# Altium project AMC_uBACKPLANE.PrjPcb (part 2 of 4)

## Sheet CLKs.SchDoc: CLKs
size 420 x 297 mm; Organization: Altium Limited; Address1: L3, 12a Rodborough Rd; Address2: Frenchs Forest; Address3: NSW; Address4: Australia 2086; DocumentNumber: 13; SheetNumber: 8; SheetTotal: 15
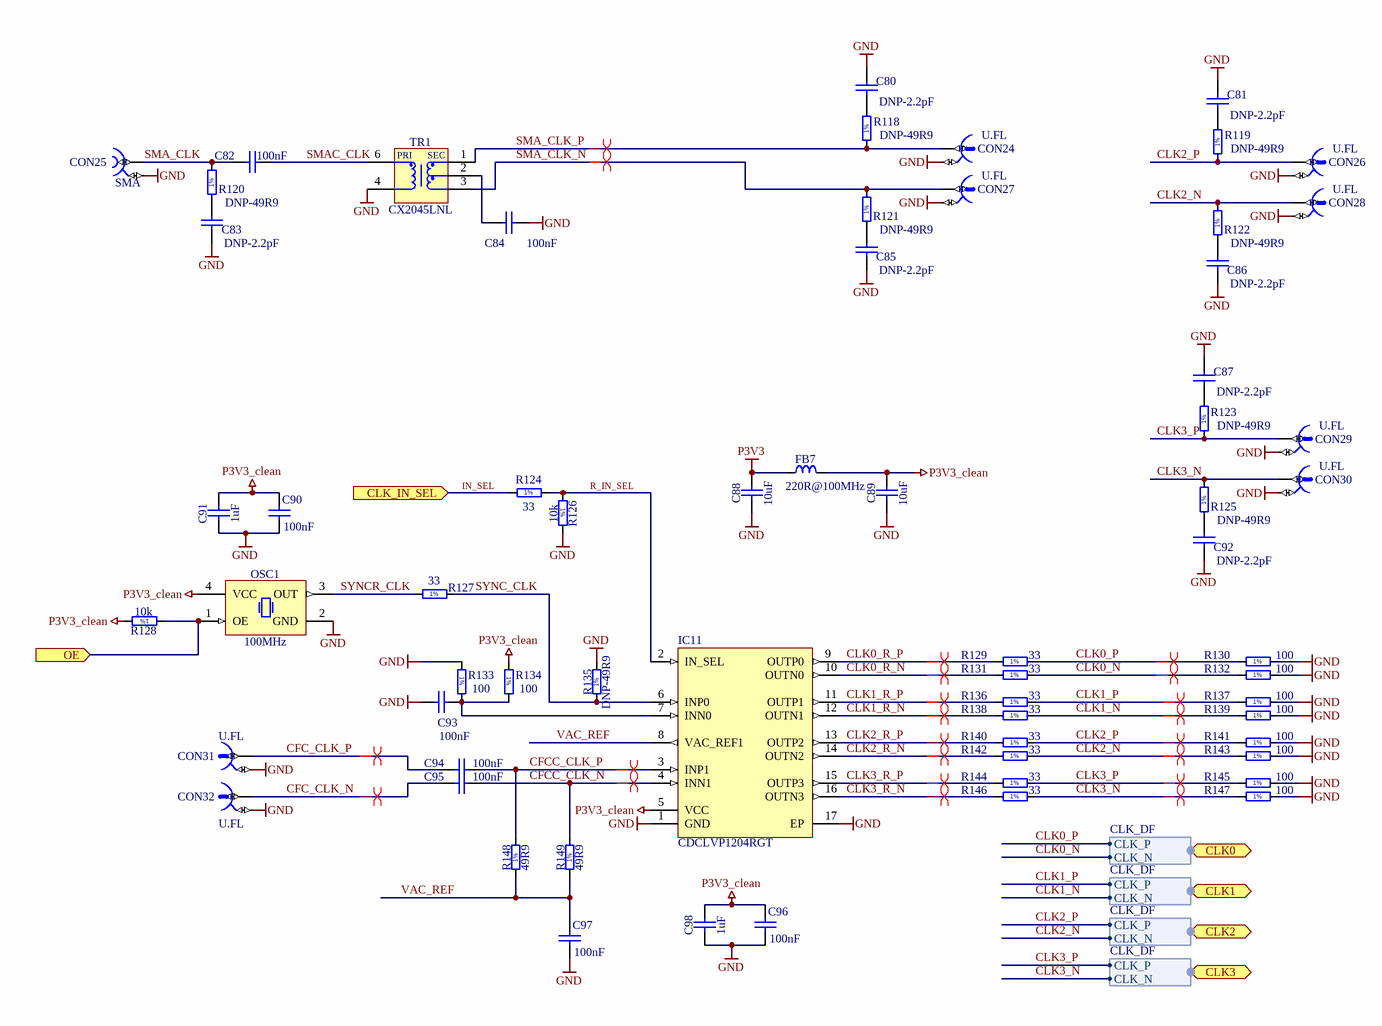
[diagram p4: CLKs.SchDoc]

### Parts
C80  DNP-2.2pF  [CAPC1005X55N]
C81  DNP-2.2pF  [CAPC1005X55N]
C82  100nF  [CAPC0603X33N]
C83  DNP-2.2pF  [CAPC1005X55N]
C84  100nF  [CAPC0603X33N]
C85  DNP-2.2pF  [CAPC1005X55N]
C86  DNP-2.2pF  [CAPC1005X55N]
C87  DNP-2.2pF  [CAPC1005X55N]
C88  10uF  [CAPC2012X135N]
C89  10uF  [CAPC2012X135N]
C90  100nF  [CAPC0603X33N]
C91  1uF  [CAPC1608X87N]
C92  DNP-2.2pF  [CAPC1005X55N]
C93  100nF  [CAPC1005X55N]
C94  100nF  [CAPC0603X33N]
C95  100nF  [CAPC0603X33N]
C96  100nF  [CAPC0603X33N]
C97  100nF  [CAPC1005X55N]
C98  1uF  [CAPC1608X87N]
CON24  U.FL  [HIROSE_U.FL-R-SMT-1(10)]
CON25  SMA  [HUBER-SUHNER_85 SMA-50-0-101/111 NE]
CON26  U.FL  [HIROSE_U.FL-R-SMT-1(10)]
CON27  U.FL  [HIROSE_U.FL-R-SMT-1(10)]
CON28  U.FL  [HIROSE_U.FL-R-SMT-1(10)]
CON29  U.FL  [HIROSE_U.FL-R-SMT-1(10)]
CON30  U.FL  [HIROSE_U.FL-R-SMT-1(10)]
CON31  U.FL  [HIROSE_U.FL-R-SMT-1(10)]
CON32  U.FL  [HIROSE_U.FL-R-SMT-1(10)]
FB7  220R@100MHz  [INDC2012X105N]
IC11  CDCLVP1204RGT  [QFN50P300X300X100-17N-S165]
OSC1  100MHz  [OSC_EPSON_SG-8002CA]
R118  DNP-49R9  [RESC1005X40N]
R119  DNP-49R9  [RESC1005X40N]
R120  DNP-49R9  [RESC1005X40N]
R121  DNP-49R9  [RESC1005X40N]
R122  DNP-49R9  [RESC1005X40N]
R123  DNP-49R9  [RESC1005X40N]
R124  33  [RESC1005X40N]
R125  DNP-49R9  [RESC1005X40N]
R126  10k  [RESC1005X40N]
R127  33  [RESC1005X40N]
R128  10k  [RESC1005X40N]
R129  33  [RESC1005X40N]
R130  100  [RESC1005X40N]
R131  33  [RESC1005X40N]
R132  100  [RESC1005X40N]
R133  100  [RESC1005X40N]
R134  100  [RESC1005X40N]
R135  DNP-49R9  [RESC1005X40N]
R136  33  [RESC1005X40N]
R137  100  [RESC1005X40N]
R138  33  [RESC1005X40N]
R139  100  [RESC1005X40N]
R140  33  [RESC1005X40N]
R141  100  [RESC1005X40N]
R142  33  [RESC1005X40N]
R143  100  [RESC1005X40N]
R144  33  [RESC1005X40N]
R145  100  [RESC1005X40N]
R146  33  [RESC1005X40N]
R147  100  [RESC1005X40N]
R148  49R9  [RESC1005X40N]
R149  49R9  [RESC1005X40N]
TR1  CX2045LNL  [PULSE_CX2045LNL]

### Ports
CLK0 (harness CLK_DF), CLK1 (harness CLK_DF), CLK2 (harness CLK_DF), CLK3 (harness CLK_DF), CLK_IN_SEL (in), OE (in)

### Harnesses
CLK_DF: CLK_P, CLK_N

### Nets
GND: C80.2 C81.2 C83.2 C84.1 C85.2 C86.2 C87.2 C88.1 C89.1 C90.1 C91.1 C92.2 C93.1 C96.1 C97.1 C98.1 CON24.2 CON25.2 CON26.2 CON27.2 CON28.2 CON29.2 CON30.2 CON31.2 CON32.2 IC11.1(GND) IC11.17(EP) OSC1.2(GND) R126.2 R130.2 R132.2 R133.1 R135.2 R137.2 R139.2 R141.2 R143.2 R145.2 R147.2 TR1.4
P3V3: C88.2 FB7.1
P3V3_clean: C89.2 C90.2 C91.2 C96.2 C98.2 FB7.2 IC11.5(VCC) OSC1.4(VCC) R128.2 R134.1
CFC_CLK_N: C95.2 CON32.1
CFC_CLK_P: C94.2 CON31.1
CFCC_CLK_N: C95.1 IC11.4(INN1) R149.2
CFCC_CLK_P: C94.1 IC11.3(INP1) R148.2
CLK0_N: R131.2 R132.1 ; port CLK0.CLK_N
CLK0_P: R129.2 R130.1 ; port CLK0.CLK_P
CLK0_R_N: IC11.10(OUTN0) R131.1
CLK0_R_P: IC11.9(OUTP0) R129.1
CLK1_N: R138.2 R139.1 ; port CLK1.CLK_N
CLK1_P: R136.2 R137.1 ; port CLK1.CLK_P
CLK1_R_N: IC11.12(OUTN1) R138.1
CLK1_R_P: IC11.11(OUTP1) R136.1
CLK2_N: CON28.1 R122.2 R142.2 R143.1 ; port CLK2.CLK_N
CLK2_P: CON26.1 R119.1 R140.2 R141.1 ; port CLK2.CLK_P
CLK2_R_N: IC11.14(OUTN2) R142.1
CLK2_R_P: IC11.13(OUTP2) R140.1
CLK3_N: CON30.1 R125.2 R146.2 R147.1 ; port CLK3.CLK_N
CLK3_P: CON29.1 R123.1 R144.2 R145.1 ; port CLK3.CLK_P
CLK3_R_N: IC11.16(OUTN3) R146.1
CLK3_R_P: IC11.15(OUTP3) R144.1
CLK_EN: OSC1.1(OE) R128.1 ; port OE
IN_SEL: R124.1 ; port CLK_IN_SEL  [project net CLK_SEL]
R_IN_SEL: IC11.2(IN_SEL) R124.2 R126.1
SMA_CLK: C82.2 CON25.1 R120.2
SMA_CLK_N: CON27.1 R121.2 TR1.3
SMA_CLK_P: CON24.1 R118.1 TR1.1
SMAC_CLK: C82.1 TR1.6
SYNC_CLK: IC11.6(INP0) R127.2 R135.1
SYNCR_CLK: OSC1.3(OUT) R127.1
VAC_REF: C97.2 IC11.8(VAC_REF1) R148.1 R149.1
NetC80_1: C80.1 R118.2
NetC81_1: C81.1 R119.2
NetC83_1: C83.1 R120.1
NetC84_2: C84.2 TR1.2
NetC85_1: C85.1 R121.1
NetC86_1: C86.1 R122.1
NetC87_1: C87.1 R123.2
NetC92_1: C92.1 R125.1
NetC93_2: C93.2 IC11.7(INN0) R133.2 R134.2

### Layout directives
differential pair: CFC_CLK_N, CFC_CLK_P, CFCC_CLK_N, CFCC_CLK_P, CLK0_N, CLK0_P, CLK0_R_N, CLK0_R_P, CLK1_N, CLK1_P, CLK1_R_N, CLK1_R_P, CLK2_N, CLK2_P, CLK2_R_N, CLK2_R_P, CLK3_N, CLK3_P, CLK3_R_N, CLK3_R_P, SMA_CLK_N, SMA_CLK_P

### Notes on the sheet
- Project/Equipment
- Document
- uTCA RTM 8 SFP+
- Designer
- Drawn by
- Check.by
- Copyright Creotech Instruments SA 2014.
  This documentation describes Open Hardware and is licensed under the CERN OHL v.1.1. You may redistribute and modify this documentation under the terms of the CERN OHL v.1.1. (http://ohwr.org/CERNOHL). This documentation is distributed WITHOUT ANY EXPRESS OR IMPLIED WARRANTY, INCLUDING OF MERCHANTABILITY, SATISFACTORY QUALITY AND FITNESS FOR A PARTICULAR PURPOSE. Please see the CERN OHL v.1.1 for applicable conditions.
- Creotech Instruments S.A.
- File
- Last Mod.
- Print Date
- Sheet
- Size
- A3
- of
- Rev
- (in symbol PULSE_CX2045LNL) PRI; SEC
- (in symbol R0402_10K_1%_0.0625W_100PPM) 1%
- (in symbol R0402_33R_1%_0.0625W_100PPM) 1%
- (in symbol R0402_49R9_1%_0.0625W_100PPM) 1%
- (in symbol R0402_100R_1%_0.0625W_100PPM) 1%

### Library data of the parts
C80 C81 C83 C85-C87 C92 = CC0402_2.2PF_50V_0.25PF_NP0: Non-polarised capacitor; Part Description: SMD Multilayer Chip Ceramic Capacitor; Manufacturer: GENERIC; Manufacturer1 Part Number: 223886915228; Voltage: 50V; TC: NP0; Tolerance: ±0.25pF; Table: Capacitors SMD; Part Number: CC0402_2.2PF_50V_0.25PF_NP0; Component Kind: Standard; Component Type: Standard; Pin Count: 2; Value: DNP-2.2pF; Status: Not Recommended; Manufacturer Part Number: CC0402_2.2PF_50V_0.25PF_NP0; Case: 0402; Mounted: Yes; Socket: No; SMD: Yes; Manufacturer1 Example: PHYCOMP; Manufacturer1 ComponentHeight: 0.55mm; HelpURL: \\cern.ch\dfs\Applications\Altium\Datasheets\CC0402_NP0_PHYCOMP.pdf; Author: CERN DEM JLC; CreateDate: 2007-12-03; LatestRevisionDate: 2007-12-03
C82 C84 C90 C94-C96 = CC0201_100NF_6.3V_10%_X5R: as C27 on sheet CPU; Part Number: CC0201_100NF_6.3V_10%_X5R; Component Kind: Standard; Component Type: Standard; Pin Count: 2; Value: 100nF; Status: Not Recommended; Manufacturer Part Number: CC0201_100NF_6.3V_10%_X5R; Case: 0201; Mounted: Yes; Socket: No; SMD: Yes; Manufacturer1 Example: AVX; Manufacturer1 ComponentHeight: 0.33mm; HelpURL: \\cern.ch\dfs\Applications\Altium\Datasheets\CC0201_X5R_AVX.pdf; Author: CERN DEM JLC; CreateDate: 2007-12-03; LatestRevisionDate: 2007-12-03
C88 C89 = CC0805_10UF_10V_10%_X7R: Non-polarised capacitor; Part Description: SMD Multilayer Chip Ceramic Capacitor; Manufacturer: GENERIC; Manufacturer1 Part Number: GRM21BR71A106KE51L; Voltage: 10V; TC: X7R; Tolerance: ±10%; Table: Capacitors SMD; Part Number: CC0805_10UF_10V_10%_X7R; Component Kind: Standard; Component Type: Standard; Pin Count: 2; Value: 10uF; Status: Preferred; Manufacturer Part Number: CC0805_10UF_10V_10%_X7R; Case: 0805; Mounted: Yes; Socket: No; SMD: Yes; Manufacturer1 Example: MURATA; Manufacturer1 ComponentHeight: 1.35mm; HelpURL: \\cern.ch\dfs\Applications\Altium\Datasheets\CC0805_X7R_MURATA.pdf; Author: CERN DEM JLC; CreateDate: 2012-04-30; LatestRevisionDate: 2012-04-30
C91 C98 = CC0603_1UF_25V_10%_X7R: Non-polarised capacitor; Part Description: SMD Multilayer Chip Ceramic Capacitor; Manufacturer: GENERIC; Manufacturer1 Part Number: GRM188R71E105KA12D; Voltage: 25V; TC: X7R; Tolerance: ±10%; Table: Capacitors SMD; Part Number: CC0603_1UF_25V_10%_X7R; Component Kind: Standard; Component Type: Standard; Pin Count: 2; Value: 1uF; Status: None; Manufacturer Part Number: CC0603_1UF_25V_10%_X7R; Case: 0603; Mounted: Yes; Socket: No; SMD: Yes; Manufacturer1 Example: MURATA; Manufacturer1 ComponentHeight: 0.9mm; HelpURL: \\cern.ch\dfs\Applications\Altium\Datasheets\CC0603_X7R_MURATA.pdf; Author: CERN DEM JLC; CreateDate: 2011-01-18; LatestRevisionDate: 2011-01-18
C93 C97 = CC0402_100NF_16V_10%_X7R: Non-polarised capacitor; Part Description: SMD Multilayer Chip Ceramic Capacitor; Manufacturer: GENERIC; Manufacturer1 Part Number: 223878715649; Voltage: 16V; TC: X7R; Tolerance: ±10%; Table: Capacitors SMD; Part Number: CC0402_100NF_16V_10%_X7R; Component Kind: Standard; Component Type: Standard; Pin Count: 2; Value: 100nF; Status: Not Recommended; Manufacturer Part Number: CC0402_100NF_16V_10%_X7R; Case: 0402; Mounted: Yes; Socket: No; SMD: Yes; Manufacturer1 Example: PHYCOMP; Manufacturer1 ComponentHeight: 0.55mm; HelpURL: \\cern.ch\dfs\Applications\Altium\Datasheets\CC0402_X7R_PHYCOMP.pdf; Author: CERN DEM JLC; CreateDate: 2007-12-03; LatestRevisionDate: 2007-12-03
CON24 CON26-CON32 = HIROSE_U.FL-R-SMT-1(10): Part Description: Up to 6GHz Ultra Small Surface Mount Male Coaxial Connectors U.FL Series; Manufacturer: HIROSE (HRS); Table: Miscellaneous; Part Number: HIROSE_U.FL-R-SMT-1(10); Component Kind: Standard; Component Type: Standard; Pin Count: 2; Family: U.FL; Mounted: Yes; Socket: No; SMD: Yes; Status: None; Manufacturer Part Number: U.FL-R-SMT-1(10); ComponentHeight: 1.25mm; HelpURL: \\cern.ch\dfs\Applications\Altium\Datasheets\HIROSE_U.FL-R-SMT-1(10).pdf; Author: CERN DEM JLC; CreateDate: 2010-03-24; LatestRevisionDate: 2010-03-24
CON25 = HUBER-SUHNER_85_SMA-50-0-101/111_NE: Part Description: SMA 50 Ohms Right Angle PCB Jack; Manufacturer: HUBER+SUHNER; Table: Miscellaneous; Part Number: HUBER-SUHNER_85_SMA-50-0-101/111_NE; Component Kind: Standard; Component Type: Standard; Pin Count: 2; Family: SMA; Mounted: Yes; Socket: No; SMD: No; Status: None; Manufacturer Part Number: 85_SMA-50-0-101/111_NE; ComponentHeight: 9.6mm; HelpURL: \\cern.ch\dfs\Applications\Altium\Datasheets\HUBER-SUHNER_85 SMA-50-0-101-111 NE.pdf; Author: CERN DEM JLC; CreateDate: 2010-04-20; LatestRevisionDate: 2010-04-27
FB7 = IND0805_MURATA_BLM21PG221SN1D: Inductor; Part Description: SMD EMIFIL Suppression Chip Ferrite Bead; Manufacturer: MURATA; Power: 2A; Resistance: 0.05R; Tolerance: ±25%; Table: Inductors SMD; Part Number: IND0805_MURATA_BLM21PG221SN1D; Component Kind: Standard; Component Type: Standard; Pin Count: 2; Value: 220R@100MHz; Status: None; Manufacturer Part Number: BLM21PG221SN1D; Case: 0805; Mounted: Yes; Socket: No; SMD: Yes; ComponentHeight: 1.05mm; HelpURL: \\cern.ch\dfs\Applications\Altium\Datasheets\IND0402_MURATA_BLM21P.pdf; Author: CERN DEM JLC; CreateDate: 2010-01-25; LatestRevisionDate: 2010-01-25
IC11 = CDCLVP1204RGT: 2:2 Low Additive Jitter LVPECL Buffer
OSC1 = OSC_100MHZ_EPSON_SG-8002CAPCB100MHZ: Oscillator 4 pins 1=OE 2=GND 3=OUT 4=VCC; Part Description: 3.3V ±50ppm 15pF -40..85°C, Output Enable Function , Surface Mount Crystal Oscillator (SG-8002CA Serie); Manufacturer: EPSON-TOYOCOM; Table: Crystals & Oscillators; Part Number: OSC_100MHZ_EPSON_SG-8002CAPCB100MHZ; Component Kind: Standard; Component Type: Standard; PackageDescription: SMD Oscillator, Side Convave, 4 pins, 5.00x7.00mm SG-8002CA Serie; Value: 100MHz; Manufacturer Part Number: SG-8002CA PCB 100MHZ; Pin Count: 4; Mounted: Yes; Socket: No; SMD: Yes; ComponentHeight: 1.5mm; HelpURL: \\cern.ch\dfs\Applications\Altium\Datasheets\OSC_EPSON_SG-8002CA.pdf; Author: CERN DEM JLC; CreateDate: 2011-05-02; LatestRevisionDate: 2011-05-02
R118-R123 R125 R135 R148 R149 = R0402_49R9_1%_0.0625W_100PPM: Resistor - 1%; Part Description: General Purpose Thick Film Chip Resistor; Manufacturer: GENERIC; Manufacturer1 Part Number: 232270674999L or RC0402FR-0749R9L; TC: ±100ppm/°C; Table: Resistors SMD; Part Number: R0402_49R9_1%_0.0625W_100PPM; Component Kind: Standard; Component Type: Standard; Pin Count: 2; Status: Not recommended; Power: 0.0625W; Tolerance: ±1%; Manufacturer Part Number: R0402_49R9_1%_0.0625W_100PPM; Case: 0402; Mounted: Yes; Socket: No; SMD: Yes; Manufacturer1 Example: YAGEO PHYCOMP; Manufacturer1 ComponentHeight: 0.4mm; HelpURL: \\cern.ch\dfs\Applications\Altium\Datasheets\R0402_Phycomp_RC0402.pdf; Author: CERN DEM JLC; CreateDate: 2012-10-24; LatestRevisionDate: 2012-10-24
  R118-R123 R125 R135: Value: DNP-49R9
  R148 R149: Value: 49R9
R124 R127 R129 R131 R136 R138 R140 R142 R144 R146 = R0402_33R_1%_0.0625W_100PPM: Resistor - 1%; Part Description: General Purpose Thick Film Chip Resistor; Manufacturer: GENERIC; Manufacturer1 Part Number: 232270673309L; TC: ±100ppm/°C; Table: Resistors SMD; Part Number: R0402_33R_1%_0.0625W_100PPM; Component Kind: Standard; Component Type: Standard; Pin Count: 2; Value: 33; Status: Not recommended; Power: 0.0625W; Tolerance: ±1%; Manufacturer Part Number: R0402_33R_1%_0.0625W_100PPM; Case: 0402; Mounted: Yes; Socket: No; SMD: Yes; Manufacturer1 Example: YAGEO PHYCOMP; Manufacturer1 ComponentHeight: 0.4mm; HelpURL: \\cern.ch\dfs\Applications\Altium\Datasheets\R0402_Phycomp_RC0402.pdf; Author: CERN DEM JLC; CreateDate: 2007-12-03; LatestRevisionDate: 2012-10-17
R126 R128 = R0402_10K_1%_0.0625W_100PPM: Resistor - 1%; Part Description: General Purpose Thick Film Chip Resistor; Manufacturer: GENERIC; Manufacturer1 Part Number: 232270671003L; TC: ±100ppm/°C; Table: Resistors SMD; Part Number: R0402_10K_1%_0.0625W_100PPM; Component Kind: Standard; Component Type: Standard; Pin Count: 2; Value: 10k; Status: Not recommended; Power: 0.0625W; Tolerance: ±1%; Manufacturer Part Number: R0402_10K_1%_0.0625W_100PPM; Case: 0402; Mounted: Yes; Socket: No; SMD: Yes; Manufacturer1 Example: YAGEO PHYCOMP; Manufacturer1 ComponentHeight: 0.4mm; HelpURL: \\cern.ch\dfs\Applications\Altium\Datasheets\R0402_Phycomp_RC0402.pdf; Author: CERN DEM JLC; CreateDate: 2007-12-03; LatestRevisionDate: 2012-10-17
R130 R132-R134 R137 R139 R141 R143 R145 R147 = R0402_100R_1%_0.0625W_100PPM: Resistor - 1%; Part Description: General Purpose Thick Film Chip Resistor; Manufacturer: GENERIC; Manufacturer1 Part Number: 232270671001L; TC: ±100ppm/°C; Table: Resistors SMD; Part Number: R0402_100R_1%_0.0625W_100PPM; Component Kind: Standard; Component Type: Standard; Pin Count: 2; Value: 100; Status: Not recommended; Power: 0.0625W; Tolerance: ±1%; Manufacturer Part Number: R0402_100R_1%_0.0625W_100PPM; Case: 0402; Mounted: Yes; Socket: No; SMD: Yes; Manufacturer1 Example: YAGEO PHYCOMP; Manufacturer1 ComponentHeight: 0.4mm; HelpURL: \\cern.ch\dfs\Applications\Altium\Datasheets\R0402_Phycomp_RC0402.pdf; Author: CERN DEM JLC; CreateDate: 2007-12-03; LatestRevisionDate: 2012-10-17
TR1 = PULSE_CX2045LNL: Balun (Ruthroff Balun Transformer) Impedance - Unbalanced/Balanced 1:2 (1:1.41 Turn Ratio)

## Sheet SFP.SchDoc: SFP
size 420 x 297 mm; Organization: Altium Limited; Address1: L3, 12a Rodborough Rd; Address2: Frenchs Forest; Address3: NSW; Address4: Australia 2086; DocumentNumber: 15; SheetNumber: 5; SheetTotal: 15
Used 4 times, as channels SFPA1, SFPA0, SFPB1, SFPB0. Parts and nets are listed once, with the designators drawn on the sheet.
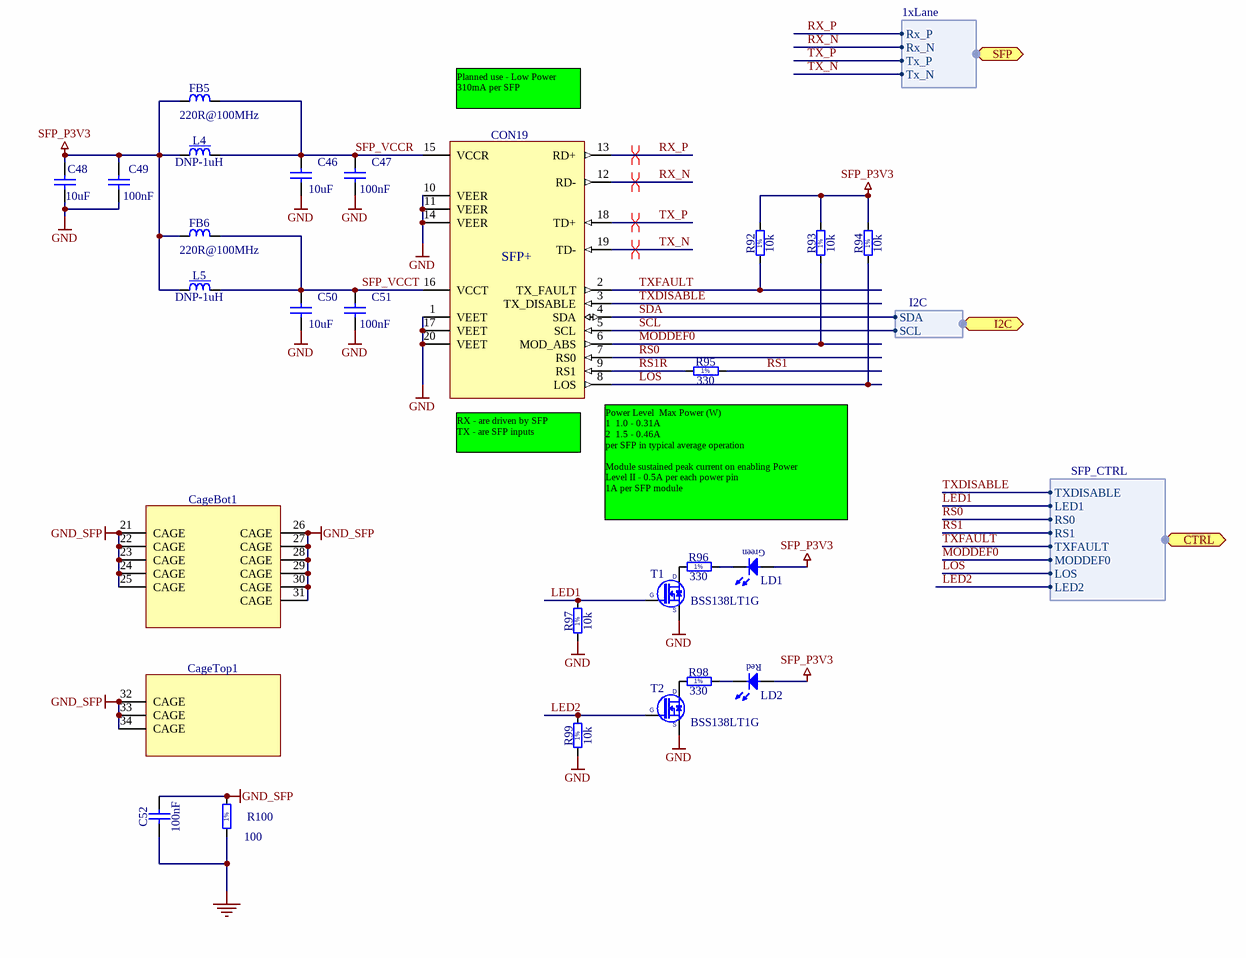
[diagram p5: SFP.SchDoc]

### Parts
C46  10uF  [CAPC2012X135N]
C47  100nF  [CAPC1005X55N]
C48  10uF  [CAPC2012X135N]
C49  100nF  [CAPC1005X55N]
C50  10uF  [CAPC2012X135N]
C51  100nF  [CAPC1005X55N]
C52  100nF  [CAPC1005X55N]
CageBot1  6367034-1  [TYCO_6367034-1]  (value not drawn)
CageTop1  6367035-1  [TYCO_6367035-1]  (value not drawn)
CON19  1888247-1  [TYCO_1888247-1]  (value not drawn)
FB5  220R@100MHz  [INDC2012X105N]
FB6  220R@100MHz  [INDC2012X105N]
L4  DNP-1uH  [IND_MURATA_LQH32]
L5  DNP-1uH  [IND_MURATA_LQH32]
LD1  LED_AVAGO_HSME-C120  [LED_AVAGO_HSME-C120]  (value not drawn)
LD2  LED_AVAGO_HSMC-C120  [LED_AVAGO_HSMC-C120]  (value not drawn)
R92  10k  [RESC1005X40N]
R93  10k  [RESC1005X40N]
R94  10k  [RESC1005X40N]
R95  330  [RESC1608X55N]
R96  330  [RESC1608X55N]
R97  10k  [RESC1005X40N]
R98  330  [RESC1608X55N]
R99  10k  [RESC1005X40N]
R100  100  [RESC1005X40N]
T1  BSS138LT1G  [SOT95P240X110-3N]
T2  BSS138LT1G  [SOT95P240X110-3N]

### Ports
CTRL (harness SFP_CTRL), I2C (harness I2C), SFP (harness 1xLane)

### Harnesses
I2C: SCL, SDA
SFP_CTRL: LED1, TXFAULT, TXDISABLE, MODDEF0, RS0, RS1, LOS, LED2
1xLane: Rx_P, Rx_N, Tx_P, Tx_N

### Nets
GND: C46.2 C47.1 C48.2 C49.2 C50.2 C51.1 C52.1 CON19.1(VEET) CON19.10(VEER) CON19.11(VEER) CON19.14(VEER) CON19.17(VEET) CON19.20(VEET) R97.1 R99.1 R100.1 T1.2(S) T2.2(S)
GND_SFP: C52.2 CageBot1.21(CAGE) CageBot1.22(CAGE) CageBot1.23(CAGE) CageBot1.24(CAGE) CageBot1.25(CAGE) CageBot1.26(CAGE) CageBot1.27(CAGE) CageBot1.28(CAGE) CageBot1.29(CAGE) CageBot1.30(CAGE) CageBot1.31(CAGE) CageTop1.32(CAGE) CageTop1.33(CAGE) CageTop1.34(CAGE) R100.2
SFP_P3V3: C48.1 C49.1 FB5.1 FB6.1 L4.1 L5.1 LD1.2(A) LD2.2(A) R92.2 R93.2 R94.2
LED1: R97.2 T1.1(G) ; port CTRL.LED1
LED2: R99.2 T2.1(G) ; port CTRL.LED2
LOS: CON19.8(LOS) R94.1 ; port CTRL.LOS
MODDEF0: CON19.6(MOD_ABS) R93.1 ; port CTRL.MODDEF0
RS0: CON19.7(RS0) ; port CTRL.RS0
RS1: R95.2 ; port CTRL.RS1
RS1R: CON19.9(RS1) R95.1
RX_N: CON19.12(RD-) ; port SFP.Rx_N
RX_P: CON19.13(RD+) ; port SFP.Rx_P
SCL: CON19.5(SCL) ; port I2C.SCL
SDA: CON19.4(SDA) ; port I2C.SDA
SFP_VCCR: C46.1 C47.2 CON19.15(VCCR) FB5.2 L4.2
SFP_VCCT: C50.1 C51.2 CON19.16(VCCT) FB6.2 L5.2
TX_N: CON19.19(TD-) ; port SFP.Tx_N
TX_P: CON19.18(TD+) ; port SFP.Tx_P
TXDISABLE: CON19.3(TX_DISABLE) ; port CTRL.TXDISABLE
TXFAULT: CON19.2(TX_FAULT) R92.1 ; port CTRL.TXFAULT
NetLD1_1: LD1.1(C) R96.2
NetLD2_1: LD2.1(C) R98.2
NetR96_1: R96.1 T1.3(D)
NetR98_1: R98.1 T2.3(D)

### Channels
SFPA1: designators end in A
SFPA0: designators end in B
SFPB1: designators end in C
SFPB0: designators end in D

### Layout directives
differential pair: P1A_SFP.Rx_N, P1A_SFP.Rx_P, P1A_SFP.Tx_N, P1A_SFP.Tx_P

### Notes on the sheet
- (near CON19) Planned use - Low Power
  310mA per SFP
- (near CON19) RX - are driven by SFP
  TX - are SFP inputs
- Power Level  Max Power (W)
  1  1.0 - 0.31A
  2  1.5 - 0.46A
  per SFP in typical average operation
  Module sustained peak current on enabling Power
  Level II - 0.5A per each power pin
  1A per SFP module
- Project/Equipment
- Document
- uTCA RTM 8 SFP+
- Designer
- Drawn by
- Check.by
- Copyright Creotech Instruments SA 2014.
  This documentation describes Open Hardware and is licensed under the CERN OHL v.1.1. You may redistribute and modify this documentation under the terms of the CERN OHL v.1.1. (http://ohwr.org/CERNOHL). This documentation is distributed WITHOUT ANY EXPRESS OR IMPLIED WARRANTY, INCLUDING OF MERCHANTABILITY, SATISFACTORY QUALITY AND FITNESS FOR A PARTICULAR PURPOSE. Please see the CERN OHL v.1.1 for applicable conditions.
- Creotech Instruments S.A.
- File
- Last Mod.
- Print Date
- Sheet
- Size
- A3
- of
- Rev
- (in symbol R0402_10K_1%_0.0625W_100PPM) 1%
- (in symbol R0402_100R_1%_0.0625W_100PPM) 1%
- (in symbol R0603_330R_1%_0.1W_100PPM) 1%

### Library data of the parts
C46 C48 C50 = CC0805_10UF_10V_10%_X7R: as C88 on sheet CLKs; Part Number: CC0805_10UF_10V_10%_X7R; Component Kind: Standard; Component Type: Standard; Pin Count: 2; Value: 10uF; Status: Preferred; Manufacturer Part Number: CC0805_10UF_10V_10%_X7R; Case: 0805; Mounted: Yes; Socket: No; SMD: Yes; Manufacturer1 Example: MURATA; Manufacturer1 ComponentHeight: 1.35mm; HelpURL: \\cern.ch\dfs\Applications\Altium\Datasheets\CC0805_X7R_MURATA.pdf; Author: CERN DEM JLC; CreateDate: 2012-04-30; LatestRevisionDate: 2012-04-30
C47 C51 C52 = CC0402_100NF_16V_10%_X5R: Non-polarised capacitor; Part Description: SMD Multilayer Chip Ceramic Capacitor; Manufacturer: GENERIC; Manufacturer1 Part Number: GRM155R61C104KA88D; Voltage: 16V; TC: X5R; Tolerance: ±10%; Table: Capacitors SMD; Part Number: CC0402_100NF_16V_10%_X5R; Component Kind: Standard; Component Type: Standard; Pin Count: 2; Value: 100nF; Status: None; Manufacturer Part Number: CC0402_100NF_16V_10%_X5R; Case: 0402; Mounted: Yes; Socket: No; SMD: Yes; Manufacturer1 Example: MURATA; Manufacturer1 ComponentHeight: 0.55mm; HelpURL: \\cern.ch\dfs\Applications\Altium\Datasheets\CC0402_X5R_MURATA_GRM.pdf; Author: CERN DEM JLC; CreateDate: 2013-12-10; LatestRevisionDate: 2013-12-10
C49 = CC0402_100NF_16V_10%_X7R: as C93 on sheet CLKs; Part Number: CC0402_100NF_16V_10%_X7R; Component Kind: Standard; Component Type: Standard; Pin Count: 2; Value: 100nF; Status: Not Recommended; Manufacturer Part Number: CC0402_100NF_16V_10%_X7R; Case: 0402; Mounted: Yes; Socket: No; SMD: Yes; Manufacturer1 Example: PHYCOMP; Manufacturer1 ComponentHeight: 0.55mm; HelpURL: \\cern.ch\dfs\Applications\Altium\Datasheets\CC0402_X7R_PHYCOMP.pdf; Author: CERN DEM JLC; CreateDate: 12/3/2007; LatestRevisionDate: 12/3/2007
CageBot1 = TYCO_6367034-1: SFP  Cage Bottom (Small Form-factor Pluggable); Part Description: Cage bottom For Single Port SFP  (Small Form-factor Pluggable); Manufacturer: TYCO ELECTRONICS; Table: TYCO; Part Number: TYCO_6367034-1; Component Kind: Standard; Component Type: Standard; Pin Count: 11; Family: SFP; Mounted: Yes; Socket: No; SMD: No; Status: None; Manufacturer Part Number: 6367034-1; ComponentHeight: 8.8mm; ComponentLink1URL: \\cern.ch\dfs\Applications\Altium\Datasheets\TYCO_SFP_Application.pdf; ComponentLink1Description: Application; ComponentLink2URL: \\cern.ch\dfs\Applications\Altium\Datasheets\Tyco_SFP_Specification.pdf; ComponentLink2Description: SFP Specification; HelpURL: \\cern.ch\dfs\Applications\Altium\Datasheets\TYCO_6367034-1.pdf; Author: CERN DEM JLC; CreateDate: 2010-01-25; LatestRevisionDate: 2010-01-25
CageTop1 = TYCO_6367035-1: SFP  Cage Top (Small Form-factor Pluggable); Part Description: Cage Top For Single Port SFP  (Small Form-factor Pluggable); Manufacturer: TYCO ELECTRONICS; Table: TYCO; Part Number: TYCO_6367035-1; Component Kind: Standard; Component Type: Standard; Pin Count: 3; Family: SFP; Mounted: Yes; Socket: No; SMD: No; Status: None; Manufacturer Part Number: 6367035-1; ComponentHeight: 10mm; ComponentLink1URL: \\cern.ch\dfs\Applications\Altium\Datasheets\TYCO_SFP_Application.pdf; ComponentLink1Description: Application; ComponentLink2URL: \\cern.ch\dfs\Applications\Altium\Datasheets\Tyco_SFP_Specification.pdf; ComponentLink2Description: SFP Specification; HelpURL: \\cern.ch\dfs\Applications\Altium\Datasheets\TYCO_6367035-1.pdf; Author: CERN DEM JLC; CreateDate: 2010-01-25; LatestRevisionDate: 2010-01-25
CON19 = TYCO_1888247-1: 20 Position SFP+ Connector (Small Form-factor Pluggable); Part Description: 20 Position, Pitch 0.8mm SFP+  Receptacle (Small Form-factor Pluggable); Manufacturer: TYCO ELECTRONICS; Table: TYCO; Part Number: TYCO_1888247-1; Component Kind: Standard; Component Type: Standard; Pin Count: 20; Family: SFP+; Mounted: Yes; Socket: No; SMD: Yes; Status: None; Manufacturer Part Number: 1888247-1; ComponentHeight: 5.4mm; HelpURL: \\cern.ch\dfs\Applications\Altium\Datasheets\TYCO_1888247-1.pdf; Author: CERN DEM JLC; CreateDate: 2012-02-27; LatestRevisionDate: 2012-02-27
FB5 FB6 = IND0805_MURATA_BLM21PG221SN1D: as FB7 on sheet CLKs; Part Number: IND0805_MURATA_BLM21PG221SN1D; Component Kind: Standard; Component Type: Standard; Pin Count: 2; Value: 220R@100MHz; Status: None; Manufacturer Part Number: BLM21PG221SN1D; Case: 0805; Mounted: Yes; Socket: No; SMD: Yes; ComponentHeight: 1.05mm; HelpURL: \\cern.ch\dfs\Applications\Altium\Datasheets\IND0402_MURATA_BLM21P.pdf; Author: CERN DEM JLC; CreateDate: 2010-01-25; LatestRevisionDate: 2010-01-25
L4 L5 = IND_1UH_20%_MURATA_LQH32CN1R0M33: Inductor With Magnetic core; Part Description: Chip Inductor (Chip Coil) for Choke Wire Wound Type; Manufacturer: MURATA; Manufacturer Part Number: LQH32CN1R0M33L; Power: 1A; Resistance: 0.06R; Tolerance: ±20%; Table: Inductors SMD; Part Number: IND_1UH_20%_MURATA_LQH32CN1R0M33; Component Kind: Standard; Component Type: Standard; Pin Count: 2; Value: DNP-1uH; Status: None; Mounted: Yes; Socket: No; SMD: Yes; ComponentHeight: 2.2mm; HelpURL: \\cern.ch\dfs\Applications\Altium\Datasheets\IND_MURATA_LQH32.pdf; Author: CERN DEM JLC; CreateDate: 2012-08-14; LatestRevisionDate: 2012-08-20
LD1 = LED_AVAGO_HSME-C120: LED Green 1C 2A; Part Description: High Performance Right Angle Chip Green LED; Manufacturer: AVAGO TECHNOLOGIES; Table: LEDs & Displays; Part Number: LED_AVAGO_HSME-C120; Component Kind: Standard; Component Type: Standard; Color: Green; PackageDescription: Green Chip LED, 2-Leads, Body 1.7x1.1mm, Side Emitting Package; Manufacturer Part Number: HSME-C120; Pin Count: 2; Mounted: Yes; Socket: No; SMD: Yes; ComponentHeight: 0.7mm; HelpURL: \\cern.ch\dfs\Applications\Altium\Datasheets\LED_AVAGO_HSME-C120.pdf; ComponentLink1URL: \\cern.ch\dfs\Applications\Altium\Datasheets\LED_AVAGO_HSME-C110_DESIGN-GUIDE.pdf; ComponentLink1Description: Design Guide; Author: CERN DEM JMW; CreateDate: 2009-07-22; LatestRevisionDate: 2012-06-20
LD2 = LED_AVAGO_HSMC-C120: LED Red 1C 2A; Part Description: High Performance Right Angle Chip Red LED; Manufacturer: AVAGO TECHNOLOGIES; Table: LEDs & Displays; Part Number: LED_AVAGO_HSMC-C120; Component Kind: Standard; Component Type: Standard; Color: Red; PackageDescription: Red Chip LED, 2-Leads, Body 1.7x1.1mm, Side Emitting Package; Manufacturer Part Number: HSMC-C120; Pin Count: 2; Mounted: Yes; Socket: No; SMD: Yes; ComponentHeight: 0.7mm; HelpURL: \\cern.ch\dfs\Applications\Altium\Datasheets\LED_AVAGO_HSMC-C120.pdf; ComponentLink1URL: \\cern.ch\dfs\Applications\Altium\Datasheets\LED_AVAGO_HSMC-C120_DESIGN-GUIDE.pdf; ComponentLink1Description: Design Guide; Author: CERN DEM JMW; CreateDate: 2009-07-22; LatestRevisionDate: 2012-06-20
R92-R94 R97 R99 = R0402_10K_1%_0.0625W_100PPM: as R126 on sheet CLKs; Part Number: R0402_10K_1%_0.0625W_100PPM; Component Kind: Standard; Component Type: Standard; Pin Count: 2; Value: 10k; Status: Not recommended; Power: 0.0625W; Tolerance: ±1%; Manufacturer Part Number: R0402_10K_1%_0.0625W_100PPM; Case: 0402; Mounted: Yes; Socket: No; SMD: Yes; Manufacturer1 Example: YAGEO PHYCOMP; Manufacturer1 ComponentHeight: 0.4mm; HelpURL: \\cern.ch\dfs\Applications\Altium\Datasheets\R0402_Phycomp_RC0402.pdf; Author: CERN DEM JLC; CreateDate: 2007-12-03; LatestRevisionDate: 2012-10-17
R95 R96 R98 = R0603_330R_1%_0.1W_100PPM: Resistor - 1%; Part Description: General Purpose Thick Film Chip Resistor; Manufacturer: GENERIC; Manufacturer1 Part Number: NRC06F3300TRF; Power: 0.1W; TC: ±100ppm/°C; Table: Resistors SMD; Part Number: R0603_330R_1%_0.1W_100PPM; Component Kind: Standard; Component Type: Standard; Pin Count: 2; Value: 330; Status: Preferred; Tolerance: ±1%; Manufacturer Part Number: R0603_330R_1%_0.1W_100PPM; Case: 0603; Mounted: Yes; Socket: No; SMD: Yes; Manufacturer1 Example: NIC COMPONENT; Manufacturer1 ComponentHeight: 0.55mm; HelpURL: \\cern.ch\dfs\Applications\Altium\Datasheets\R0603_NIC_NRC.pdf; Author: CERN DEM JLC; CreateDate: 2007-12-03; LatestRevisionDate: 2008-03-13
R100 = R0402_100R_1%_0.0625W_100PPM: as R130 on sheet CLKs; Part Number: R0402_100R_1%_0.0625W_100PPM; Component Kind: Standard; Component Type: Standard; Pin Count: 2; Value: 100; Status: Not recommended; Power: 0.0625W; Tolerance: ±1%; Manufacturer Part Number: R0402_100R_1%_0.0625W_100PPM; Case: 0402; Mounted: Yes; Socket: No; SMD: Yes; Manufacturer1 Example: YAGEO PHYCOMP; Manufacturer1 ComponentHeight: 0.4mm; HelpURL: \\cern.ch\dfs\Applications\Altium\Datasheets\R0402_Phycomp_RC0402.pdf; Author: CERN DEM JLC; CreateDate: 2007-12-03; LatestRevisionDate: 2012-10-17
T1 T2 = BSS138LT1G: N-CHANNEL MOSFET WITH DIODE; Part Description: 50V 200mA N-Channel Enhancement Mode Field-Effect Transistor; Manufacturer: ON SEMICONDUCTOR; Table: Transistors; Part Number: BSS138LT1G; Component Kind: Standard; Component Type: Standard; Device: BSS138LT1G; PackageDescription: SOT23 3-Leads, Pitch 0.95mm - Body 1.4x3mm, IPC Medium Density; Manufacturer Part Number: BSS138LT1G; Pin Count: 3; Case: SOT23-3; Mounted: Yes; Socket: No; SMD: Yes; ComponentHeight: 1.11mm; HelpURL: \\cern.ch\dfs\Applications\Altium\Datasheets\BSS138LT1G.pdf; Author: CERN DEM JLC; CreateDate: 2009-03-23; LatestRevisionDate: 2009-03-23

## Sheet AMC.SchDoc: AMC
size 420 x 297 mm; DocumentNumber: 1; SheetNumber: 7; SheetTotal: 15
Used 2 times, as channels ACC, AFC. Parts and nets are listed once, with the designators drawn on the sheet.
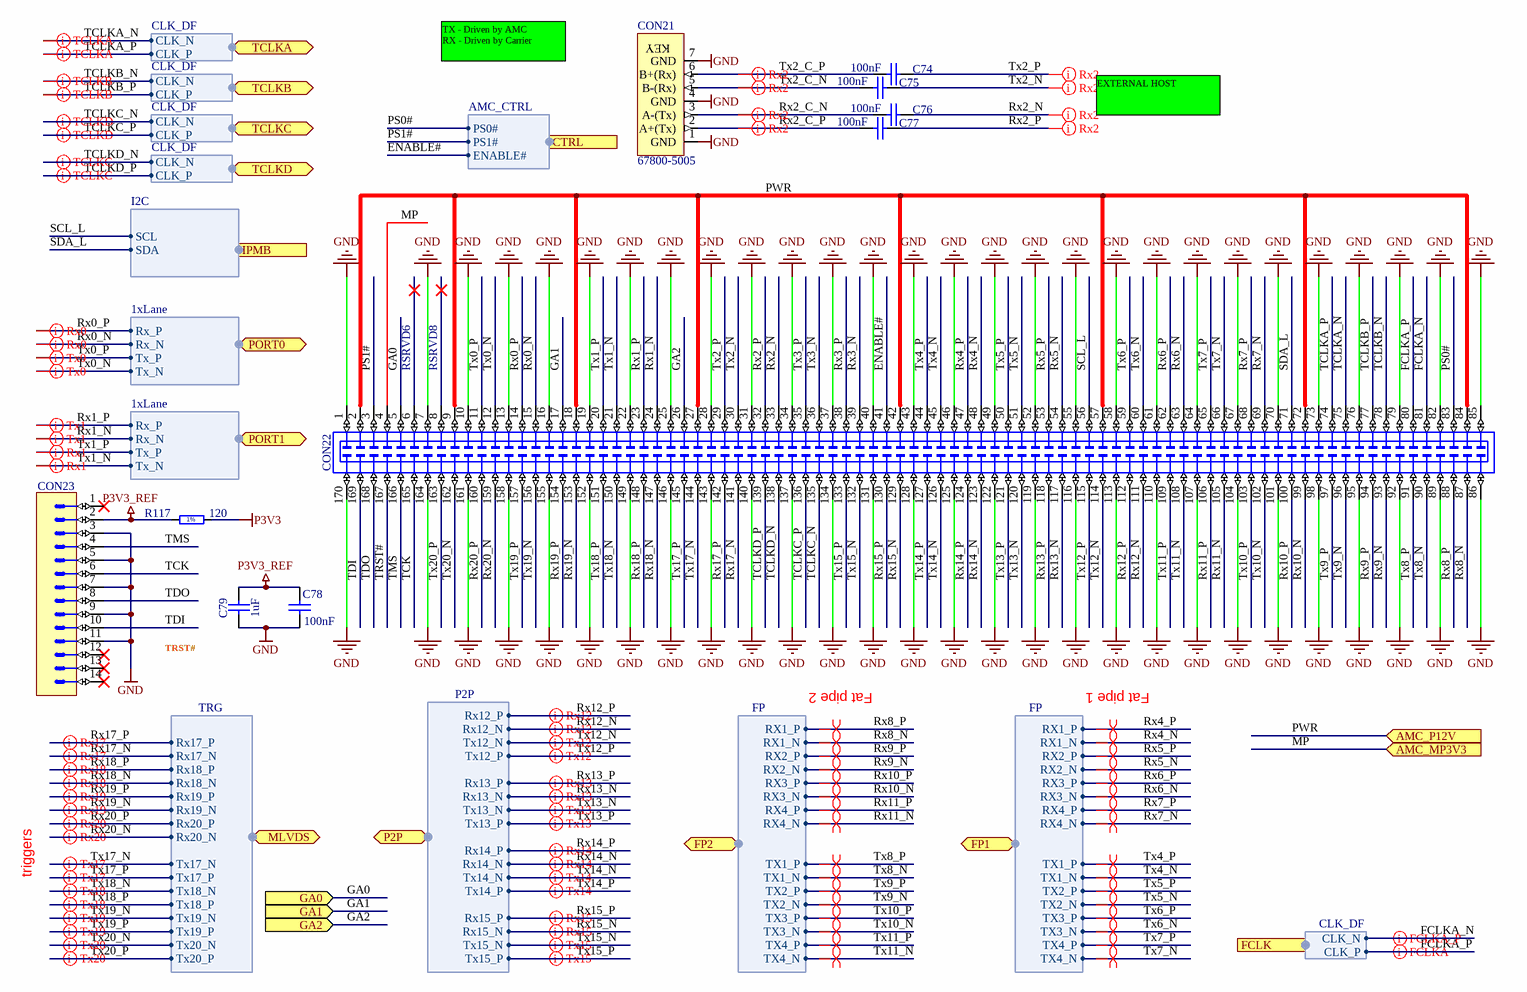
[diagram p6: AMC.SchDoc]

### Parts
C74  100nF  [CAPC0603X33N]
C75  100nF  [CAPC0603X33N]
C76  100nF  [CAPC0603X33N]
C77  100nF  [CAPC0603X33N]
C78  100nF  [CAPC0603X33N]
C79  1uF  [CAPC1608X87N]
CON21  67800-5005  [CON_SATA_V]
CON22  SAMTEC_MTCA-085-02-S-DV-SMT-K-TR  [SAMTEC_MTCA-085-02-S-DV-SMT-K-TR]  (value not drawn)
CON23  MOLEX_87832-1420  [MOLEX_87832-1420]  (value not drawn)
R117  120  [RESC1005X40N]

### Ports
AMC_MP3V3 (in), AMC_P12V (in), CTRL (harness AMC_CTRL), FCLK (harness CLK_DF), FP1 (harness FP), FP2 (harness FP), GA0 (in), GA1 (in), GA2 (in), IPMB (harness I2C), MLVDS (harness TRG), P2P (harness P2P), PORT0 (harness 1xLane), PORT1 (harness 1xLane), TCLKA (harness CLK_DF), TCLKB (harness CLK_DF), TCLKC (harness CLK_DF), TCLKD (harness CLK_DF)

### Harnesses
TRG: Rx17_P, Rx17_N, Rx18_P, Rx18_N, Rx19_P, Rx19_N, Rx20_P, Rx20_N, Tx17_N, Tx17_P, Tx18_N, Tx18_P, Tx19_N, Tx19_P, Tx20_N, Tx20_P
1xLane: Rx_P, Rx_N, Tx_P, Tx_N
FP: RX1_P, RX1_N, RX2_N, RX2_P, TX1_P, TX1_N, TX2_N, TX2_P, RX3_P, RX3_N, RX4_N, RX4_P, TX3_P, TX3_N, TX4_N, TX4_P
I2C: SCL, SDA
P2P: Rx12_P, Rx12_N, Tx12_N, Tx12_P, Rx13_P, Rx13_N, Tx13_N, Tx13_P, Rx14_P, Rx14_N, Tx14_N, Tx14_P, Rx15_P, Rx15_N, Tx15_N, Tx15_P
CLK_DF: CLK_P, CLK_N
AMC_CTRL: PS0#, PS1#, ENABLE#

### Nets
GND: C78.1 C79.1 CON21.1(GND) CON21.4(GND) CON21.7(GND) CON22.1 CON22.7 CON22.10 CON22.13 CON22.16 CON22.19 CON22.22 CON22.25 CON22.28 CON22.31 CON22.34 CON22.37 CON22.40 CON22.43 CON22.46 CON22.49 CON22.52 CON22.55 CON22.58 CON22.61 CON22.64 CON22.67 CON22.70 CON22.73 CON22.76 CON22.79 CON22.82 CON22.85 CON22.86 CON22.89 CON22.92 CON22.95 CON22.98 CON22.101 CON22.104 CON22.107 CON22.110 CON22.113 CON22.116 CON22.119 CON22.122 CON22.125 CON22.128 CON22.131 CON22.134 CON22.137 CON22.140 CON22.143 CON22.146 CON22.149 CON22.152 CON22.155 CON22.158 CON22.161 CON22.164 CON22.170 CON23.3 CON23.5 CON23.7 CON23.9 CON23.11
P3V3: R117.2
P3V3_REF: C78.2 C79.2 CON23.2 R117.1
ENABLE#: CON22.41 ; port CTRL.ENABLE#
FCLKA_N: CON22.81 ; port FCLK.CLK_N
FCLKA_P: CON22.80 ; port FCLK.CLK_P
GA0: CON22.5 ; port GA0
GA1: CON22.17 ; port GA1
GA2: CON22.26 ; port GA2
MP: CON22.4 ; port AMC_MP3V3
PS0#: CON22.83 ; port CTRL.PS0#
PS1#: CON22.3 ; port CTRL.PS1#
PWR: CON22.2 CON22.9 CON22.18 CON22.27 CON22.42 CON22.57 CON22.72 CON22.84 ; port AMC_P12V
Rx0_N: CON22.15 ; port PORT0.Rx_N
Rx0_P: CON22.14 ; port PORT0.Rx_P
Rx1_N: CON22.24 ; port PORT1.Rx_N
Rx1_P: CON22.23 ; port PORT1.Rx_P
Rx2_C_N: C76.1 CON21.3(A-(Tx))
Rx2_C_P: C77.1 CON21.2(A+(Tx))
Rx2_N: C76.2 CON22.33
Rx2_P: C77.2 CON22.32
Rx3_N: CON22.39
Rx3_P: CON22.38
Rx4_N: CON22.48 ; port FP1.RX1_N
Rx4_P: CON22.47 ; port FP1.RX1_P
Rx5_N: CON22.54 ; port FP1.RX2_N
Rx5_P: CON22.53 ; port FP1.RX2_P
Rx6_N: CON22.63 ; port FP1.RX3_N
Rx6_P: CON22.62 ; port FP1.RX3_P
Rx7_N: CON22.69 ; port FP1.RX4_N
Rx7_P: CON22.68 ; port FP1.RX4_P
Rx8_N: CON22.87 ; port FP2.RX1_N
Rx8_P: CON22.88 ; port FP2.RX1_P
Rx9_N: CON22.93 ; port FP2.RX2_N
Rx9_P: CON22.94 ; port FP2.RX2_P
Rx10_N: CON22.99 ; port FP2.RX3_N
Rx10_P: CON22.100 ; port FP2.RX3_P
Rx11_N: CON22.105 ; port FP2.RX4_N
Rx11_P: CON22.106 ; port FP2.RX4_P
Rx12_N: CON22.111 ; port P2P.Rx12_N
Rx12_P: CON22.112 ; port P2P.Rx12_P
Rx13_N: CON22.117 ; port P2P.Rx13_N
Rx13_P: CON22.118 ; port P2P.Rx13_P
Rx14_N: CON22.123 ; port P2P.Rx14_N
Rx14_P: CON22.124 ; port P2P.Rx14_P
Rx15_N: CON22.129 ; port P2P.Rx15_N
Rx15_P: CON22.130 ; port P2P.Rx15_P
Rx17_N: CON22.141 ; port MLVDS.Rx17_N
Rx17_P: CON22.142 ; port MLVDS.Rx17_P
Rx18_N: CON22.147 ; port MLVDS.Rx18_N
Rx18_P: CON22.148 ; port MLVDS.Rx18_P
Rx19_N: CON22.153 ; port MLVDS.Rx19_N
Rx19_P: CON22.154 ; port MLVDS.Rx19_P
Rx20_N: CON22.159 ; port MLVDS.Rx20_N
Rx20_P: CON22.160 ; port MLVDS.Rx20_P
SCL_L: CON22.56 ; port IPMB.SCL
SDA_L: CON22.71 ; port IPMB.SDA
TCK: CON22.165 CON23.6
TCLKA_N: CON22.75 ; port TCLKA.CLK_N
TCLKA_P: CON22.74 ; port TCLKA.CLK_P
TCLKB_N: CON22.78 ; port TCLKB.CLK_N
TCLKB_P: CON22.77 ; port TCLKB.CLK_P
TCLKC_N: CON22.135 ; port TCLKC.CLK_N
TCLKC_P: CON22.136 ; port TCLKC.CLK_P
TCLKD_N: CON22.138 ; port TCLKD.CLK_N
TCLKD_P: CON22.139 ; port TCLKD.CLK_P
TDI: CON22.169 CON23.10
TDO: CON22.168 CON23.8
TMS: CON22.166 CON23.4
TRST#: CON22.167
Tx0_N: CON22.12 ; port PORT0.Tx_N
Tx0_P: CON22.11 ; port PORT0.Tx_P
Tx1_N: CON22.21 ; port PORT1.Tx_N
Tx1_P: CON22.20 ; port PORT1.Tx_P
Tx2_C_N: C75.1 CON21.5(B-(Rx))
Tx2_C_P: C74.1 CON21.6(B+(Rx))
Tx2_N: C75.2 CON22.30
Tx2_P: C74.2 CON22.29
Tx3_N: CON22.36
Tx3_P: CON22.35
Tx4_N: CON22.45 ; port FP1.TX1_N
Tx4_P: CON22.44 ; port FP1.TX1_P
Tx5_N: CON22.51 ; port FP1.TX2_N
Tx5_P: CON22.50 ; port FP1.TX2_P
Tx6_N: CON22.60 ; port FP1.TX3_N
Tx6_P: CON22.59 ; port FP1.TX3_P
Tx7_N: CON22.66 ; port FP1.TX4_N
Tx7_P: CON22.65 ; port FP1.TX4_P
Tx8_N: CON22.90 ; port FP2.TX1_N
Tx8_P: CON22.91 ; port FP2.TX1_P
Tx9_N: CON22.96 ; port FP2.TX2_N
Tx9_P: CON22.97 ; port FP2.TX2_P
Tx10_N: CON22.102 ; port FP2.TX3_N
Tx10_P: CON22.103 ; port FP2.TX3_P
Tx11_N: CON22.108 ; port FP2.TX4_N
Tx11_P: CON22.109 ; port FP2.TX4_P
Tx12_N: CON22.114 ; port P2P.Tx12_N
Tx12_P: CON22.115 ; port P2P.Tx12_P
Tx13_N: CON22.120 ; port P2P.Tx13_N
Tx13_P: CON22.121 ; port P2P.Tx13_P
Tx14_N: CON22.126 ; port P2P.Tx14_N
Tx14_P: CON22.127 ; port P2P.Tx14_P
Tx15_N: CON22.132 ; port P2P.Tx15_N
Tx15_P: CON22.133 ; port P2P.Tx15_P
Tx17_N: CON22.144 ; port MLVDS.Tx17_N
Tx17_P: CON22.145 ; port MLVDS.Tx17_P
Tx18_N: CON22.150 ; port MLVDS.Tx18_N
Tx18_P: CON22.151 ; port MLVDS.Tx18_P
Tx19_N: CON22.156 ; port MLVDS.Tx19_N
Tx19_P: CON22.157 ; port MLVDS.Tx19_P
Tx20_N: CON22.162 ; port MLVDS.Tx20_N
Tx20_P: CON22.163 ; port MLVDS.Tx20_P

Not connected (* = marked no-connect by the designer): CON22 6* 8*; CON23 1* 12* 13* 14*

### Channels
ACC: designators end in A; ports AMC_MP3V3=P3V3 AMC_P12V=AMC2_P12V GA0=GND GA1=GA1_ACC GA2=GND
AFC: designators end in B; ports AMC_MP3V3=P3V3 AMC_P12V=AMC1_P12V GA0=GA0_AFC GA1=GND GA2=GND

### Layout directives
differential pair: ACC_A.CLK_N, ACC_A.CLK_P, ACC_B.CLK_N, ACC_B.CLK_P, ACC_C.CLK_N, ACC_C.CLK_P, ACC_D.CLK_N, ACC_D.CLK_P, CLK1_N, CLK1_P, FP2A.RX1_N, FP2A.RX1_P, FP2A.RX2_N, FP2A.RX2_P, FP2A.RX3_N, FP2A.RX3_P, FP2A.RX4_N, FP2A.RX4_P, FP2A.TX1_N, FP2A.TX1_P, FP2A.TX2_N, FP2A.TX2_P, FP2A.TX3_N, FP2A.TX3_P, FP2A.TX4_N, FP2A.TX4_P, FP_QSFPB.RX1_N, FP_QSFPB.RX1_P, FP_QSFPB.RX2_N, FP_QSFPB.RX2_P, FP_QSFPB.RX3_N, FP_QSFPB.RX3_P, FP_QSFPB.RX4_N, FP_QSFPB.RX4_P, FP_QSFPB.TX1_N, FP_QSFPB.TX1_P, FP_QSFPB.TX2_N, FP_QSFPB.TX2_P, FP_QSFPB.TX3_N, FP_QSFPB.TX3_P, FP_QSFPB.TX4_N, FP_QSFPB.TX4_P, MLVDS.Rx17_N, MLVDS.Rx17_P, MLVDS.Rx18_N, MLVDS.Rx18_P, MLVDS.Rx19_N, MLVDS.Rx19_P, MLVDS.Rx20_N, MLVDS.Rx20_P, MLVDS.Tx17_N, MLVDS.Tx17_P, MLVDS.Tx18_N, MLVDS.Tx18_P, MLVDS.Tx19_N, MLVDS.Tx19_P, MLVDS.Tx20_N, MLVDS.Tx20_P, P0B_SFP.Rx_N, P0B_SFP.Rx_P, P0B_SFP.Tx_N, P0B_SFP.Tx_P, P1B.Rx_N, P1B.Rx_P, P1B.Tx_N, P1B.Tx_P, Rx2_C_N_ACC, Rx2_C_P_ACC, Rx2_N_ACC, Rx2_P_ACC, Rx12_N_ACC, Rx12_P_ACC, Rx13_N_ACC, Rx13_P_ACC, Rx14_N_ACC, Rx14_P_ACC, Rx15_N_ACC, Rx15_P_ACC, Tx2_C_N_ACC, Tx2_C_P_ACC, Tx2_N_ACC, Tx2_P_ACC, Tx12_N_ACC, Tx12_P_ACC, Tx13_N_ACC, Tx13_P_ACC, Tx14_N_ACC, Tx14_P_ACC, Tx15_N_ACC, Tx15_P_ACC

### Notes on the sheet
- TX - Driven by AMC
  RX - Driven by Carrier
- EXTERNAL HOST
- RSRVD6
- RSRVD8
- TRST#
- Fat pipe 2
- Fat pipe 1
- triggers
- Project/Equipment
- Document
- uTCA RTM 8 SFP+
- Designer
- Drawn by
- Check.by
- Copyright Creotech Instruments SA 2014.
  This documentation describes Open Hardware and is licensed under the CERN OHL v.1.1. You may redistribute and modify this documentation under the terms of the CERN OHL v.1.1. (http://ohwr.org/CERNOHL). This documentation is distributed WITHOUT ANY EXPRESS OR IMPLIED WARRANTY, INCLUDING OF MERCHANTABILITY, SATISFACTORY QUALITY AND FITNESS FOR A PARTICULAR PURPOSE. Please see the CERN OHL v.1.1 for applicable conditions.
- Creotech Instruments S.A.
- File
- Last Mod.
- Print Date
- Sheet
- Size
- A3
- of
- Rev
- (in symbol CON_SATA_V) KEY
- (in symbol R0402_120R_1%_0.0625W_100PPM) 1%

### Library data of the parts
C74-C78 = CC0201_100NF_6.3V_10%_X5R: Non-polarised capacitor; Part Description: SMD Multilayer Chip Ceramic Capacitor; Manufacturer: GENERIC; Manufacturer1 Part Number: 02016D104KAT2A; Voltage: 6.3V; TC: X5R; Tolerance: ±10%; Table: Capacitors SMD; Part Number: CC0201_100NF_6.3V_10%_X5R; Component Kind: Standard; Component Type: Standard; Pin Count: 2; Value: 100nF; Status: Not Recommended; Manufacturer Part Number: CC0201_100NF_6.3V_10%_X5R; Case: 0201; Mounted: Yes; Socket: No; SMD: Yes; Manufacturer1 Example: AVX; Manufacturer1 ComponentHeight: 0.33mm; HelpURL: \\cern.ch\dfs\Applications\Altium\Datasheets\CC0201_X5R_AVX.pdf; Author: CERN DEM JLC; CreateDate: 2007-12-03; LatestRevisionDate: 2007-12-03
C79 = CC0603_1UF_25V_10%_X7R: Non-polarised capacitor; Part Description: SMD Multilayer Chip Ceramic Capacitor; Manufacturer: GENERIC; Manufacturer1 Part Number: GRM188R71E105KA12D; Voltage: 25V; TC: X7R; Tolerance: ±10%; Table: Capacitors SMD; Part Number: CC0603_1UF_25V_10%_X7R; Component Kind: Standard; Component Type: Standard; Pin Count: 2; Value: 1uF; Status: None; Manufacturer Part Number: CC0603_1UF_25V_10%_X7R; Case: 0603; Mounted: Yes; Socket: No; SMD: Yes; Manufacturer1 Example: MURATA; Manufacturer1 ComponentHeight: 0.9mm; HelpURL: \\cern.ch\dfs\Applications\Altium\Datasheets\CC0603_X7R_MURATA.pdf; Author: CERN DEM JLC; CreateDate: 2011-01-18; LatestRevisionDate: 2011-01-18
CON21 = CON_SATA_V: SATA conenctor  PCB Molex
CON22 = SAMTEC_MTCA-085-02-S-DV-SMT-K-TR: 170 Poles,  Micro TCA (Telecom Computing Architecture) Edge Card Socket; Part Description: 170 Poles, Pitch 0.75mm, Micro TCA (Telecom Computing Architecture) Edge Card Socket; Manufacturer: SAMTEC; Part Number: SAMTEC_MTCA-085-02-S-DV-SMT-K-TR; Component Kind: Standard; Component Type: Standard; Pin Count: 170; Mounted: Yes; Socket: No; SMD: Yes; Status: None; Manufacturer Part Number: MTCA-085-02-S-DV-SMT-K-TR; ComponentHeight: 12.85mm; HelpURL: \\cern.ch\dfs\Applications\Altium\Datasheets\SAMTEC_MTCA-085-02-S-DV-SMT-K-TR.pdf; Author: CERN DEM JLC; CreateDate: 2012-08-15; LatestRevisionDate: 2012-08-15; Table: SAMTEC
CON23 = MOLEX_87832-1420: Connector 14 Male; Part Description: 2.00mm (.079") Pitch Milli-Grid™ Header, Surface Mount, Vertical, Shrouded, 14 Circuits,with Locking Windows and Centre Polarization Slot, PCB Locator; Manufacturer: MOLEX; Part Number: MOLEX_87832-1420; Component Kind: Standard; Component Type: Standard; Pin Count: 14; Family: Milli-Grid™; Mounted: Yes; Socket: No; SMD: Yes; Status: None; Manufacturer Part Number: 87832-1420; ComponentHeight: 6.4mm; HelpURL: \\cern.ch\dfs\Applications\Altium\Datasheets\MOLEX_87832-1420.pdf; Author: CERN DEM JLC; CreateDate: 2008-09-09; LatestRevisionDate: 2008-09-09; Table: MOLEX
R117 = R0402_120R_1%_0.0625W_100PPM: Resistor - 1%; Part Description: General Purpose Thick Film Chip Resistor; Manufacturer: GENERIC; Manufacturer1 Part Number: 232270671201L; TC: ±100ppm/°C; Table: Resistors SMD; Part Number: R0402_120R_1%_0.0625W_100PPM; Component Kind: Standard; Component Type: Standard; Pin Count: 2; Value: 120; Status: Not recommended; Power: 0.0625W; Tolerance: ±1%; Manufacturer Part Number: R0402_120R_1%_0.0625W_100PPM; Case: 0402; Mounted: Yes; Socket: No; SMD: Yes; Manufacturer1 Example: YAGEO PHYCOMP; Manufacturer1 ComponentHeight: 0.4mm; HelpURL: \\cern.ch\dfs\Applications\Altium\Datasheets\R0402_Phycomp_RC0402.pdf; Author: CERN DEM JLC; CreateDate: 2007-12-03; LatestRevisionDate: 2012-10-17

## Sheet UFL.SchDoc: UFL
size 420 x 297 mm
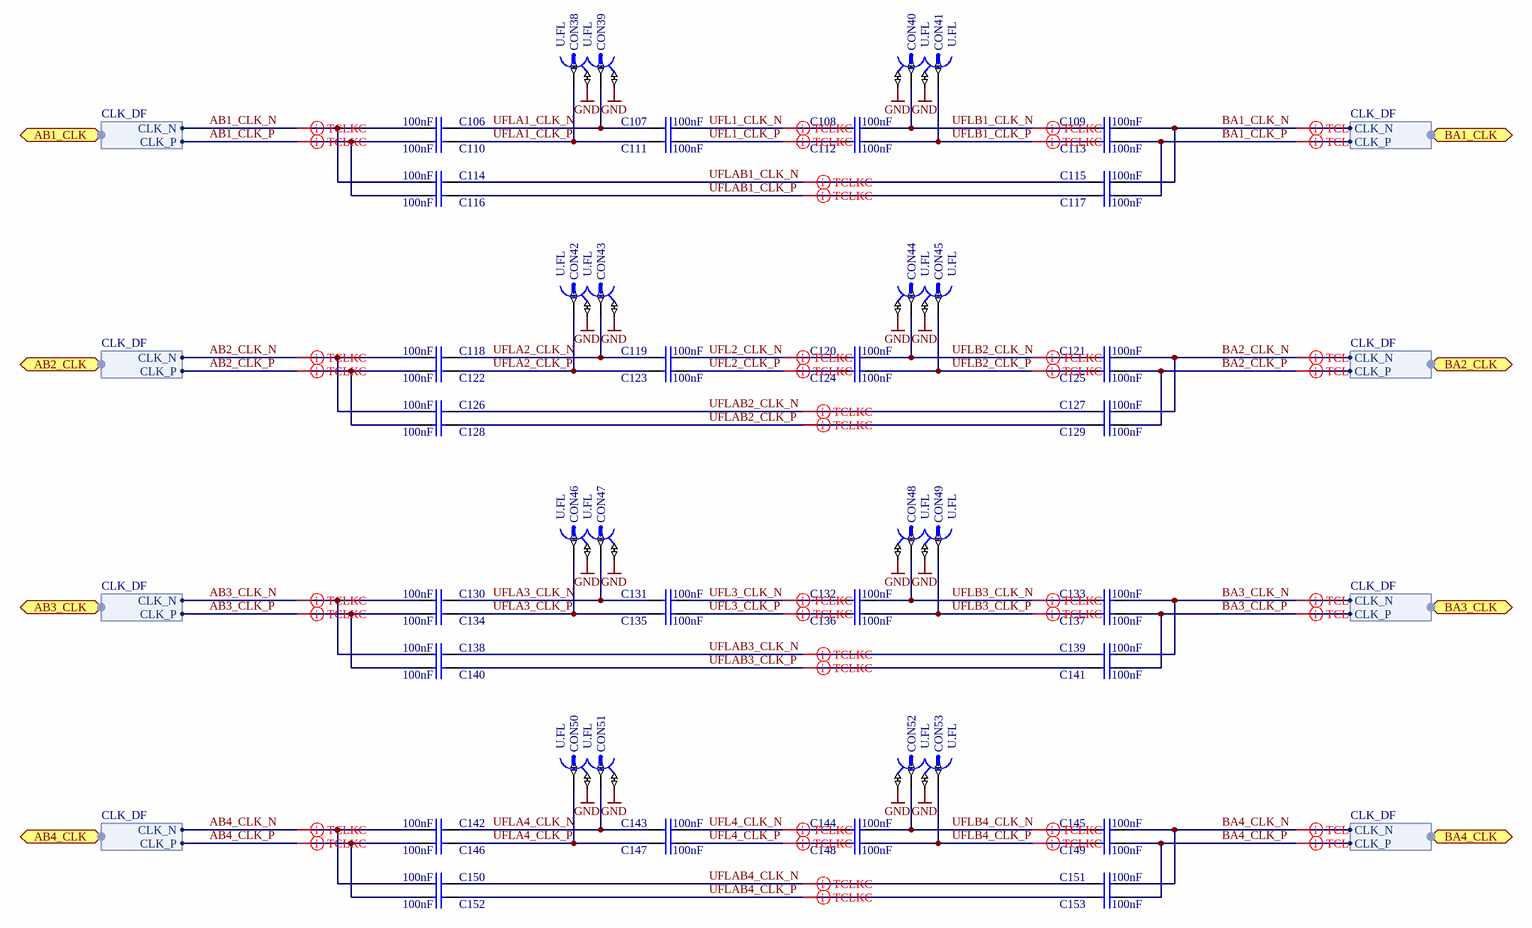
[diagram p7: UFL.SchDoc]

### Parts
C106  100nF  [CAPC0603X33N]
C107  100nF  [CAPC0603X33N]
C108  100nF  [CAPC0603X33N]
C109  100nF  [CAPC0603X33N]
C110  100nF  [CAPC0603X33N]
C111  100nF  [CAPC0603X33N]
C112  100nF  [CAPC0603X33N]
C113  100nF  [CAPC0603X33N]
C114  100nF  [CAPC0603X33N]
C115  100nF  [CAPC0603X33N]
C116  100nF  [CAPC0603X33N]
C117  100nF  [CAPC0603X33N]
C118  100nF  [CAPC0603X33N]
C119  100nF  [CAPC0603X33N]
C120  100nF  [CAPC0603X33N]
C121  100nF  [CAPC0603X33N]
C122  100nF  [CAPC0603X33N]
C123  100nF  [CAPC0603X33N]
C124  100nF  [CAPC0603X33N]
C125  100nF  [CAPC0603X33N]
C126  100nF  [CAPC0603X33N]
C127  100nF  [CAPC0603X33N]
C128  100nF  [CAPC0603X33N]
C129  100nF  [CAPC0603X33N]
C130  100nF  [CAPC0603X33N]
C131  100nF  [CAPC0603X33N]
C132  100nF  [CAPC0603X33N]
C133  100nF  [CAPC0603X33N]
C134  100nF  [CAPC0603X33N]
C135  100nF  [CAPC0603X33N]
C136  100nF  [CAPC0603X33N]
C137  100nF  [CAPC0603X33N]
C138  100nF  [CAPC0603X33N]
C139  100nF  [CAPC0603X33N]
C140  100nF  [CAPC0603X33N]
C141  100nF  [CAPC0603X33N]
C142  100nF  [CAPC0603X33N]
C143  100nF  [CAPC0603X33N]
C144  100nF  [CAPC0603X33N]
C145  100nF  [CAPC0603X33N]
C146  100nF  [CAPC0603X33N]
C147  100nF  [CAPC0603X33N]
C148  100nF  [CAPC0603X33N]
C149  100nF  [CAPC0603X33N]
C150  100nF  [CAPC0603X33N]
C151  100nF  [CAPC0603X33N]
C152  100nF  [CAPC0603X33N]
C153  100nF  [CAPC0603X33N]
CON38  U.FL  [HIROSE_U.FL-R-SMT-1(10)]
CON39  U.FL  [HIROSE_U.FL-R-SMT-1(10)]
CON40  U.FL  [HIROSE_U.FL-R-SMT-1(10)]
CON41  U.FL  [HIROSE_U.FL-R-SMT-1(10)]
CON42  U.FL  [HIROSE_U.FL-R-SMT-1(10)]
CON43  U.FL  [HIROSE_U.FL-R-SMT-1(10)]
CON44  U.FL  [HIROSE_U.FL-R-SMT-1(10)]
CON45  U.FL  [HIROSE_U.FL-R-SMT-1(10)]
CON46  U.FL  [HIROSE_U.FL-R-SMT-1(10)]
CON47  U.FL  [HIROSE_U.FL-R-SMT-1(10)]
CON48  U.FL  [HIROSE_U.FL-R-SMT-1(10)]
CON49  U.FL  [HIROSE_U.FL-R-SMT-1(10)]
CON50  U.FL  [HIROSE_U.FL-R-SMT-1(10)]
CON51  U.FL  [HIROSE_U.FL-R-SMT-1(10)]
CON52  U.FL  [HIROSE_U.FL-R-SMT-1(10)]
CON53  U.FL  [HIROSE_U.FL-R-SMT-1(10)]

### Ports
AB1_CLK (harness CLK_DF), AB2_CLK (harness CLK_DF), AB3_CLK (harness CLK_DF), AB4_CLK (harness CLK_DF), BA1_CLK (harness CLK_DF), BA2_CLK (harness CLK_DF), BA3_CLK (harness CLK_DF), BA4_CLK (harness CLK_DF)

### Harnesses
CLK_DF: CLK_P, CLK_N

### Nets
GND: CON38.2 CON39.2 CON40.2 CON41.2 CON42.2 CON43.2 CON44.2 CON45.2 CON46.2 CON47.2 CON48.2 CON49.2 CON50.2 CON51.2 CON52.2 CON53.2
AB1_CLK_N: C106.1 C114.1 ; port AB1_CLK.CLK_N  [project net AFC_A.CLK_N]
AB1_CLK_P: C110.1 C116.1 ; port AB1_CLK.CLK_P  [project net AFC_A.CLK_P]
AB2_CLK_N: C118.1 C126.1 ; port AB2_CLK.CLK_N  [project net AFC_B.CLK_N]
AB2_CLK_P: C122.1 C128.1 ; port AB2_CLK.CLK_P  [project net AFC_B.CLK_P]
AB3_CLK_N: C130.1 C138.1 ; port AB3_CLK.CLK_N  [project net AFC_C.CLK_N]
AB3_CLK_P: C134.1 C140.1 ; port AB3_CLK.CLK_P  [project net AFC_C.CLK_P]
AB4_CLK_N: C142.1 C150.1 ; port AB4_CLK.CLK_N  [project net AFC_D.CLK_N]
AB4_CLK_P: C146.1 C152.1 ; port AB4_CLK.CLK_P  [project net AFC_D.CLK_P]
BA1_CLK_N: C109.1 C115.1 ; port BA1_CLK.CLK_N  [project net ACC_A.CLK_N]
BA1_CLK_P: C113.1 C117.1 ; port BA1_CLK.CLK_P  [project net ACC_A.CLK_P]
BA2_CLK_N: C121.1 C127.1 ; port BA2_CLK.CLK_N  [project net ACC_B.CLK_N]
BA2_CLK_P: C125.1 C129.1 ; port BA2_CLK.CLK_P  [project net ACC_B.CLK_P]
BA3_CLK_N: C133.1 C139.1 ; port BA3_CLK.CLK_N  [project net ACC_C.CLK_N]
BA3_CLK_P: C137.1 C141.1 ; port BA3_CLK.CLK_P  [project net ACC_C.CLK_P]
BA4_CLK_N: C145.1 C151.1 ; port BA4_CLK.CLK_N  [project net ACC_D.CLK_N]
BA4_CLK_P: C149.1 C153.1 ; port BA4_CLK.CLK_P  [project net ACC_D.CLK_P]
UFL1_CLK_N: C107.1 C108.2
UFL1_CLK_P: C111.1 C112.2
UFL2_CLK_N: C119.1 C120.2
UFL2_CLK_P: C123.1 C124.2
UFL3_CLK_N: C131.1 C132.2
UFL3_CLK_P: C135.1 C136.2
UFL4_CLK_N: C143.1 C144.2
UFL4_CLK_P: C147.1 C148.2
UFLA1_CLK_N: C106.2 C107.2 CON39.1
UFLA1_CLK_P: C110.2 C111.2 CON38.1
UFLA2_CLK_N: C118.2 C119.2 CON43.1
UFLA2_CLK_P: C122.2 C123.2 CON42.1
UFLA3_CLK_N: C130.2 C131.2 CON47.1
UFLA3_CLK_P: C134.2 C135.2 CON46.1
UFLA4_CLK_N: C142.2 C143.2 CON51.1
UFLA4_CLK_P: C146.2 C147.2 CON50.1
UFLAB1_CLK_N: C114.2 C115.2
UFLAB1_CLK_P: C116.2 C117.2
UFLAB2_CLK_N: C126.2 C127.2
UFLAB2_CLK_P: C128.2 C129.2
UFLAB3_CLK_N: C138.2 C139.2
UFLAB3_CLK_P: C140.2 C141.2
UFLAB4_CLK_N: C150.2 C151.2
UFLAB4_CLK_P: C152.2 C153.2
UFLB1_CLK_N: C108.1 C109.2 CON40.1
UFLB1_CLK_P: C112.1 C113.2 CON41.1
UFLB2_CLK_N: C120.1 C121.2 CON44.1
UFLB2_CLK_P: C124.1 C125.2 CON45.1
UFLB3_CLK_N: C132.1 C133.2 CON48.1
UFLB3_CLK_P: C136.1 C137.2 CON49.1
UFLB4_CLK_N: C144.1 C145.2 CON52.1
UFLB4_CLK_P: C148.1 C149.2 CON53.1

### Layout directives
differential pair: ACC_A.CLK_N, ACC_A.CLK_P, ACC_B.CLK_N, ACC_B.CLK_P, ACC_C.CLK_N, ACC_C.CLK_P, ACC_D.CLK_N, ACC_D.CLK_P, AFC_A.CLK_N, AFC_A.CLK_P, AFC_B.CLK_N, AFC_B.CLK_P, AFC_C.CLK_N, AFC_C.CLK_P, AFC_D.CLK_N, AFC_D.CLK_P, UFL1_CLK_N, UFL1_CLK_P, UFL2_CLK_N, UFL2_CLK_P, UFL3_CLK_N, UFL3_CLK_P, UFL4_CLK_N, UFL4_CLK_P, UFLAB1_CLK_N, UFLAB1_CLK_P, UFLAB2_CLK_N, UFLAB2_CLK_P, UFLAB3_CLK_N, UFLAB3_CLK_P, UFLAB4_CLK_N, UFLAB4_CLK_P, UFLB1_CLK_N, UFLB1_CLK_P, UFLB2_CLK_N, UFLB2_CLK_P, UFLB3_CLK_N, UFLB3_CLK_P, UFLB4_CLK_N, UFLB4_CLK_P

### Notes on the sheet
- Project/Equipment
- Document
- uTCA RTM 8 SFP+
- Designer
- Drawn by
- Check.by
- Copyright Creotech Instruments SA 2014.
  This documentation describes Open Hardware and is licensed under the CERN OHL v.1.1. You may redistribute and modify this documentation under the terms of the CERN OHL v.1.1. (http://ohwr.org/CERNOHL). This documentation is distributed WITHOUT ANY EXPRESS OR IMPLIED WARRANTY, INCLUDING OF MERCHANTABILITY, SATISFACTORY QUALITY AND FITNESS FOR A PARTICULAR PURPOSE. Please see the CERN OHL v.1.1 for applicable conditions.
- Creotech Instruments S.A.
- File
- Last Mod.
- Print Date
- Sheet
- Size
- A3
- of
- Rev

### Library data of the parts
C106-C153 = CC0201_100NF_6.3V_10%_X5R: as C74-C78 on sheet AMC; Part Number: CC0201_100NF_6.3V_10%_X5R; Component Kind: Standard; Component Type: Standard; Pin Count: 2; Value: 100nF; Status: Not Recommended; Manufacturer Part Number: CC0201_100NF_6.3V_10%_X5R; Case: 0201; Mounted: Yes; Socket: No; SMD: Yes; Manufacturer1 Example: AVX; Manufacturer1 ComponentHeight: 0.33mm; HelpURL: \\cern.ch\dfs\Applications\Altium\Datasheets\CC0201_X5R_AVX.pdf; Author: CERN DEM JLC; CreateDate: 2007-12-03; LatestRevisionDate: 2007-12-03
CON38-CON53 = HIROSE_U.FL-R-SMT-1(10): Part Description: Up to 6GHz Ultra Small Surface Mount Male Coaxial Connectors U.FL Series; Manufacturer: HIROSE (HRS); Table: Miscellaneous; Part Number: HIROSE_U.FL-R-SMT-1(10); Component Kind: Standard; Component Type: Standard; Pin Count: 2; Family: U.FL; Mounted: Yes; Socket: No; SMD: Yes; Status: None; Manufacturer Part Number: U.FL-R-SMT-1(10); ComponentHeight: 1.25mm; HelpURL: \\cern.ch\dfs\Applications\Altium\Datasheets\HIROSE_U.FL-R-SMT-1(10).pdf; Author: CERN DEM JLC; CreateDate: 2010-03-24; LatestRevisionDate: 2010-03-24

## Sheet CrossPort.SchDoc: Cross Port
size 420 x 297 mm; DocumentNumber: 3; SheetNumber: 11; SheetTotal: 15
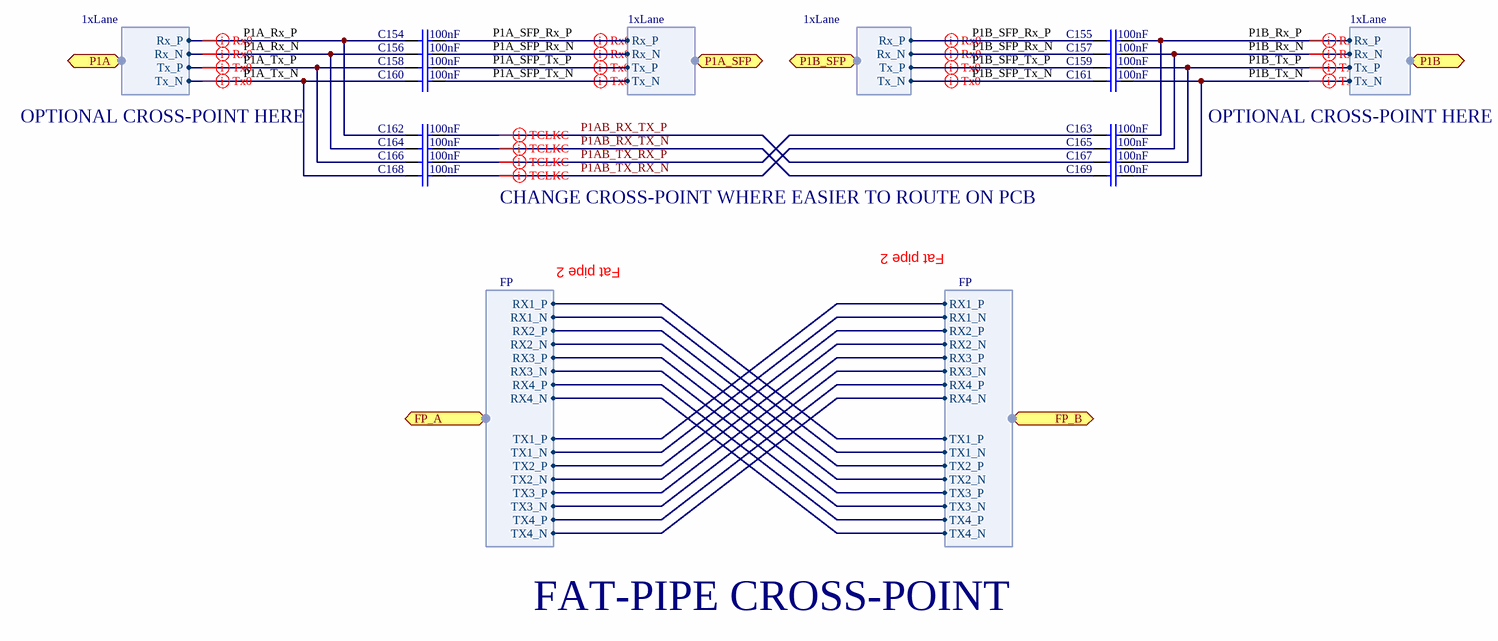
[diagram p8: CrossPort.SchDoc]

### Parts
C154  100nF  [CAPC0603X33N]
C155  100nF  [CAPC0603X33N]
C156  100nF  [CAPC0603X33N]
C157  100nF  [CAPC0603X33N]
C158  100nF  [CAPC0603X33N]
C159  100nF  [CAPC0603X33N]
C160  100nF  [CAPC0603X33N]
C161  100nF  [CAPC0603X33N]
C162  100nF  [CAPC0603X33N]
C163  100nF  [CAPC0603X33N]
C164  100nF  [CAPC0603X33N]
C165  100nF  [CAPC0603X33N]
C166  100nF  [CAPC0603X33N]
C167  100nF  [CAPC0603X33N]
C168  100nF  [CAPC0603X33N]
C169  100nF  [CAPC0603X33N]

### Ports
FP_A (harness FP), FP_B (harness FP), P1A (harness 1xLane), P1A_SFP (harness 1xLane), P1B (harness 1xLane), P1B_SFP (harness 1xLane)

### Harnesses
FP: RX1_P, RX1_N, RX2_N, RX2_P, TX1_P, TX1_N, TX2_N, TX2_P, RX3_P, RX3_N, RX4_N, RX4_P, TX3_P, TX3_N, TX4_N, TX4_P
1xLane: Rx_P, Rx_N, Tx_P, Tx_N

### Nets
FP2A.RX1_N: port FP_A.RX1_N, port FP_B.TX1_N
FP2A.RX1_P: port FP_A.RX1_P, port FP_B.TX1_P
FP2A.RX2_N: port FP_A.RX2_N, port FP_B.TX2_N
FP2A.RX2_P: port FP_A.RX2_P, port FP_B.TX2_P
FP2A.RX3_N: port FP_A.RX3_N, port FP_B.TX3_N
FP2A.RX3_P: port FP_A.RX3_P, port FP_B.TX3_P
FP2A.RX4_N: port FP_A.RX4_N, port FP_B.TX4_N
FP2A.RX4_P: port FP_A.RX4_P, port FP_B.TX4_P
FP2A.TX1_N: port FP_A.TX1_N, port FP_B.RX1_N
FP2A.TX1_P: port FP_A.TX1_P, port FP_B.RX1_P
FP2A.TX2_N: port FP_A.TX2_N, port FP_B.RX2_N
FP2A.TX2_P: port FP_A.TX2_P, port FP_B.RX2_P
FP2A.TX3_N: port FP_A.TX3_N, port FP_B.RX3_N
FP2A.TX3_P: port FP_A.TX3_P, port FP_B.RX3_P
FP2A.TX4_N: port FP_A.TX4_N, port FP_B.RX4_N
FP2A.TX4_P: port FP_A.TX4_P, port FP_B.RX4_P
P1A_Rx_N: C156.2 C164.2 ; port P1A.Rx_N  [project net P1A.Rx_N]
P1A_Rx_P: C154.2 C162.2 ; port P1A.Rx_P  [project net P1A.Rx_P]
P1A_SFP_Rx_N: C156.1 ; port P1A_SFP.Rx_N  [project net P1A_SFP.Rx_N]
P1A_SFP_Rx_P: C154.1 ; port P1A_SFP.Rx_P  [project net P1A_SFP.Rx_P]
P1A_SFP_Tx_N: C160.1 ; port P1A_SFP.Tx_N  [project net P1A_SFP.Tx_N]
P1A_SFP_Tx_P: C158.1 ; port P1A_SFP.Tx_P  [project net P1A_SFP.Tx_P]
P1A_Tx_N: C160.2 C168.2 ; port P1A.Tx_N  [project net P1A.Tx_N]
P1A_Tx_P: C158.2 C166.2 ; port P1A.Tx_P  [project net P1A.Tx_P]
P1AB_RX_TX_N: C164.1 C169.2
P1AB_RX_TX_P: C162.1 C167.2
P1AB_TX_RX_N: C165.2 C168.1
P1AB_TX_RX_P: C163.2 C166.1
P1B_Rx_N: C157.1 C165.1 ; port P1B.Rx_N  [project net P1B.Rx_N]
P1B_Rx_P: C155.1 C163.1 ; port P1B.Rx_P  [project net P1B.Rx_P]
P1B_SFP_Rx_N: C157.2 ; port P1B_SFP.Rx_N  [project net P1B_SFP.Rx_N]
P1B_SFP_Rx_P: C155.2 ; port P1B_SFP.Rx_P  [project net P1B_SFP.Rx_P]
P1B_SFP_Tx_N: C161.2 ; port P1B_SFP.Tx_N  [project net P1B_SFP.Tx_N]
P1B_SFP_Tx_P: C159.2 ; port P1B_SFP.Tx_P  [project net P1B_SFP.Tx_P]
P1B_Tx_N: C161.1 C169.1 ; port P1B.Tx_N  [project net P1B.Tx_N]
P1B_Tx_P: C159.1 C167.1 ; port P1B.Tx_P  [project net P1B.Tx_P]

### Layout directives
differential pair: P1A.Rx_N, P1A.Rx_P, P1A.Tx_N, P1A.Tx_P, P1A_SFP.Rx_N, P1A_SFP.Rx_P, P1A_SFP.Tx_N, P1A_SFP.Tx_P, P1AB_RX_TX_N, P1AB_RX_TX_P, P1AB_TX_RX_N, P1AB_TX_RX_P, P1B.Rx_N, P1B.Rx_P, P1B.Tx_N, P1B.Tx_P, P1B_SFP.Rx_N, P1B_SFP.Rx_P, P1B_SFP.Tx_N, P1B_SFP.Tx_P

### Notes on the sheet
- OPTIONAL CROSS-POINT HERE
- CHANGE CROSS-POINT WHERE EASIER TO ROUTE ON PCB
- Fat pipe 2
- FAT-PIPE CROSS-POINT
- Project/Equipment
- Document
- uTCA RTM 8 SFP+
- Designer
- Drawn by
- Check.by
- Copyright Creotech Instruments SA 2014.
  This documentation describes Open Hardware and is licensed under the CERN OHL v.1.1. You may redistribute and modify this documentation under the terms of the CERN OHL v.1.1. (http://ohwr.org/CERNOHL). This documentation is distributed WITHOUT ANY EXPRESS OR IMPLIED WARRANTY, INCLUDING OF MERCHANTABILITY, SATISFACTORY QUALITY AND FITNESS FOR A PARTICULAR PURPOSE. Please see the CERN OHL v.1.1 for applicable conditions.
- Creotech Instruments S.A.
- File
- Last Mod.
- Print Date
- Sheet
- Size
- A3
- of
- Rev

### Library data of the parts
C154-C169 = CC0201_100NF_6.3V_10%_X5R: as C74-C78 on sheet AMC; Part Number: CC0201_100NF_6.3V_10%_X5R; Component Kind: Standard; Component Type: Standard; Pin Count: 2; Value: 100nF; Status: Not Recommended; Manufacturer Part Number: CC0201_100NF_6.3V_10%_X5R; Case: 0201; Mounted: Yes; Socket: No; SMD: Yes; Manufacturer1 Example: AVX; Manufacturer1 ComponentHeight: 0.33mm; HelpURL: \\cern.ch\dfs\Applications\Altium\Datasheets\CC0201_X5R_AVX.pdf; Author: CERN DEM JLC; CreateDate: 2007-12-03; LatestRevisionDate: 2007-12-03